# Altium schematic sheet Sheet1.SchDoc
size A
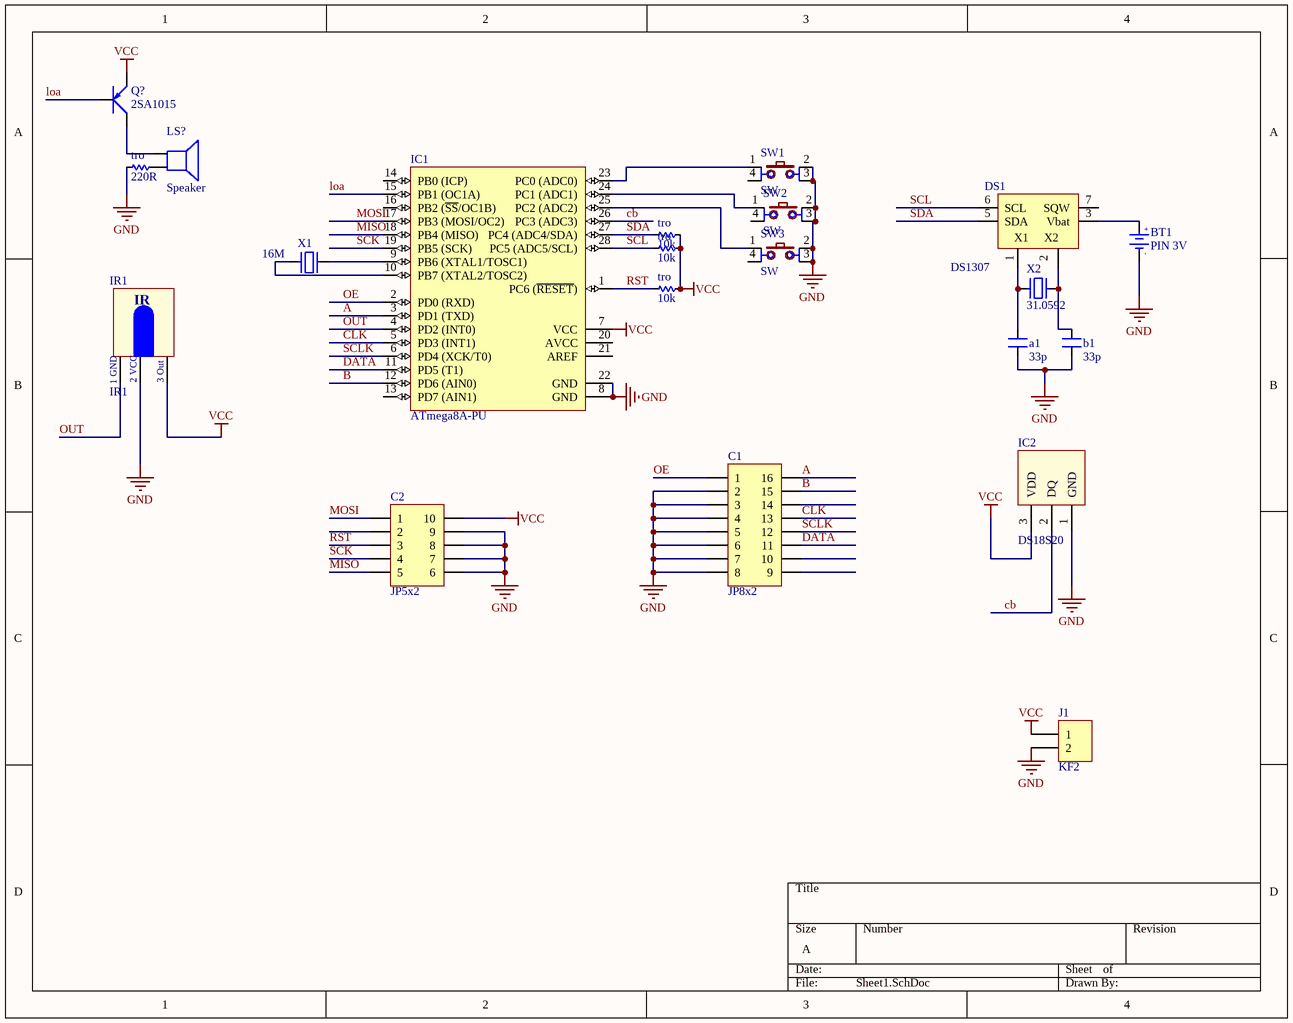
[diagram p0: Sheet1.SchDoc]

## Parts
(Parts that share a designator on the sheet are numbered #1, #2 ... from top to bottom, then left to right.)
a1  33p  [CN1]
b1  33p  [CN1]
BT1  PIN 3V  [PIN CR1220-SMD]
C1  JP8x2  [JP8-D2T]
C2  JP5x2  [JP5-D2T]
DS1  DS1307  [DIP8]
IC1  ATmega8A-PU  [DIP28]
IC2  DS18S20  [JP3-C1T]
IR1  IR1  [IR2]
J1  KF2  [KF2-5.08]
LS?  Speaker  [SPEAKER]
Q?  2SA1015  [TO92-123]
SW1  SW  [SW2-DIP]
SW2  SW  [SW2-DIP]
SW3  SW  [SW2-DIP]
tro#1  220R  [RES-SMD-0805]
tro#2  10k  [RES-SMD-0805]
tro#3  10k  [RES-SMD-0805]
tro#4  10k  [RES-SMD-0805]
X1  16M  [XT2]
X2  31.0592  [XT32k]

## Nets
GND: a1.1 b1.1 BT1.2(GND) C1.2 C1.3 C1.4 C1.5 C1.6 C1.7 C1.8 C2.6 C2.7 C2.8 C2.9 DS1.4(GND) IC1.8(GND) IC1.22(GND) IC2.1(GND) IR1.2(GND) J1.2 SW1.2 SW1.3 SW2.2 SW2.3 SW3.2 SW3.3 tro#1.2
VCC: C2.10 DS1.8(VCC) IC1.7(VCC) IC2.3(VDD) IR1.3(VCC) J1.1 Q?.1(E) tro#2.1 tro#3.1 tro#4.1
A: C1.16 IC1.3(PD1_(TXD))
B: C1.15 IC1.12(PD6_(AIN0))
cb: IC1.26(PC3_(ADC3)) IC2.2(DQ)
CLK: C1.13 IC1.5(PD3_(INT1))
DATA: C1.11 IC1.11(PD5_(T1))
loa: IC1.15(PB1_(OC1A)) Q?.3(B)
MISO: C2.5 IC1.18(PB4_(MISO))
MOSI: C2.1 IC1.17(PB3_(MOSI/OC2))
OE: C1.1 IC1.2(PD0_(RXD))
OUT: IC1.4(PD2_(INT0)) IR1.1(Out)
RST: C2.3 IC1.1(PC6_(~{RESET})) tro#4.2
SCK: C2.4 IC1.19(PB5_(SCK))
SCL: DS1.6(SCL) IC1.28(PC5_(ADC5/SCL)) tro#3.2
SCLK: C1.12 IC1.6(PD4_(XCK/T0))
SDA: DS1.5(SDA) IC1.27(PC4_(ADC4/SDA)) tro#2.2
Neta1_2: a1.2 DS1.1(X1) X2.2
Netb1_2: b1.2 DS1.2(X2) X2.1
NetBT1_1: BT1.1(+3V) DS1.3(Vbat)
NetIC1_9: IC1.9(PB6_(XTAL1/TOSC1)) X1.2
NetIC1_10: IC1.10(PB7_(XTAL2/TOSC2)) X1.1
NetIC1_23: IC1.23(PC0_(ADC0)) SW1.1
NetIC1_24: IC1.24(PC1_(ADC1)) SW2.1
NetIC1_25: IC1.25(PC2_(ADC2)) SW3.1
NetLS?_1: LS?.1 Q?.2(C)
NetLS?_2: LS?.2 tro#1.1

Not connected (* = marked no-connect by the designer): C1 9 10 14; C2 2; DS1 7(SQW); IC1 13(PD7_(AIN1)) 14(PB0_(ICP)) 16(PB2_(~{SS}/OC1B)) 20(AVCC) 21(AREF); SW1 4; SW2 4; SW3 4

## Notes on the sheet
- (in symbol IR1) IR; 1 GND; 2 VCC; 3 Out
- (in symbol PIN 3V) +; -

## Library data of the parts
a1 b1 = CN1: Cap np  1pF - 472pF; Value: 100pF
BT1 = PIN 3V: Battery 3VDC; Value: PIN 3V
C1 = JP8x2: WR-PHD 2.54 mm Dual Socket Header; Manufacturer: W¨¹rth Elektronik eiSos GmbH; partNo: 61301621821; ComponentLink1 Description: Manufacturer; ComponentLink2 Description: Datasheet; NoPins: 16; Created Date: 29 March 2013; ComponentLink1URL: http://www.we-online.com; ComponentLink2URL: http://katalog.we-online.de/em/datasheet/6130xx21821.pdf; Created by: Karrer Zheng
C2 = JP5x2: WR-PHD 2.54 mm Dual Socket Header; Manufacturer: W¨¹rth Elektronik eiSos GmbH; partNo: 61301021821; ComponentLink1 Description: Manufacturer; ComponentLink2 Description: Datasheet; NoPins: 10; Created Date: 29 March 2013; ComponentLink1URL: http://www.we-online.com; ComponentLink2URL: http://katalog.we-online.de/em/datasheet/6130xx21821.pdf; Created by: Karrer Zheng
DS1 = DS1307: Real Timer Serial; Value: DS1307
IC1 = ATmega8A-PU: 8-Bit AVR Microcontroller with 8K Bytes of In-System Programmable Flash Memory; Value: ATmega8-L
IC2 = DS18S20: High Precision  1-Wire® Digital Thermometer
IR1 = IR1: Receiver Infraed IC
J1 = KF2: Manufacturer: Würth Elektronik eiSos GmbH; partNo: 691103110002; ComponentLink1 Description: Manufacturer; ComponentLink2 Description: Datasheet; NoPins: 2; Created Date: 29 October 2013; ComponentLink1URL: http://www.we-online.com; ComponentLink2URL: http://katalog.we-online.de/em/datasheet/6911031100xx.pdf; Created by: Karrer Zheng
LS? = Speaker: Loudspeaker; Published: 24-Mar-1999; LatestRevisionDate: 17-Jul-2002; LatestRevisionNote: Re-released for DXP Platform.; PackageReference: PIN2; Publisher: Altium Limited
Q? = 2SA1015: PNP 600mW, ECB; Value: A1015
SW1-SW3 = SW4: Switch button 4 pin; Value: Button chip 4 pin
tro#1-tro#4 = Res-SMD: Resistor; Manufacturer: Generic Components; Class: Passive; Published: 08/06/2000; Publisher: Altium Hobart Technology Centre
X1 X2 = XT2: Crystal, 32.768 KHz, -40 to 85 degC, 3.2 x 1.5 x 0.9 mm SMD; Value: 4Mhz